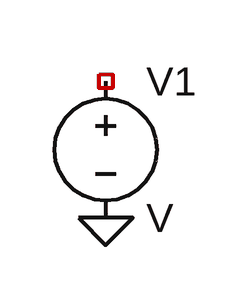
[diagram p0: schematic power_sim.asc]
power_sim.asc, the LTspice schematic file:
Version 4.1
SHEET 1 880 680
FLAG 96 160 0
SYMBOL voltage 96 64 R0
SYMATTR InstName V1

The netlist it stands for:
* power_sim.asc
V1 NC_01 0 V
.backanno
.end